# Altium schematic sheet DTM13.SchDoc
size A4; SheetNumber: 11; SheetTotal: 14
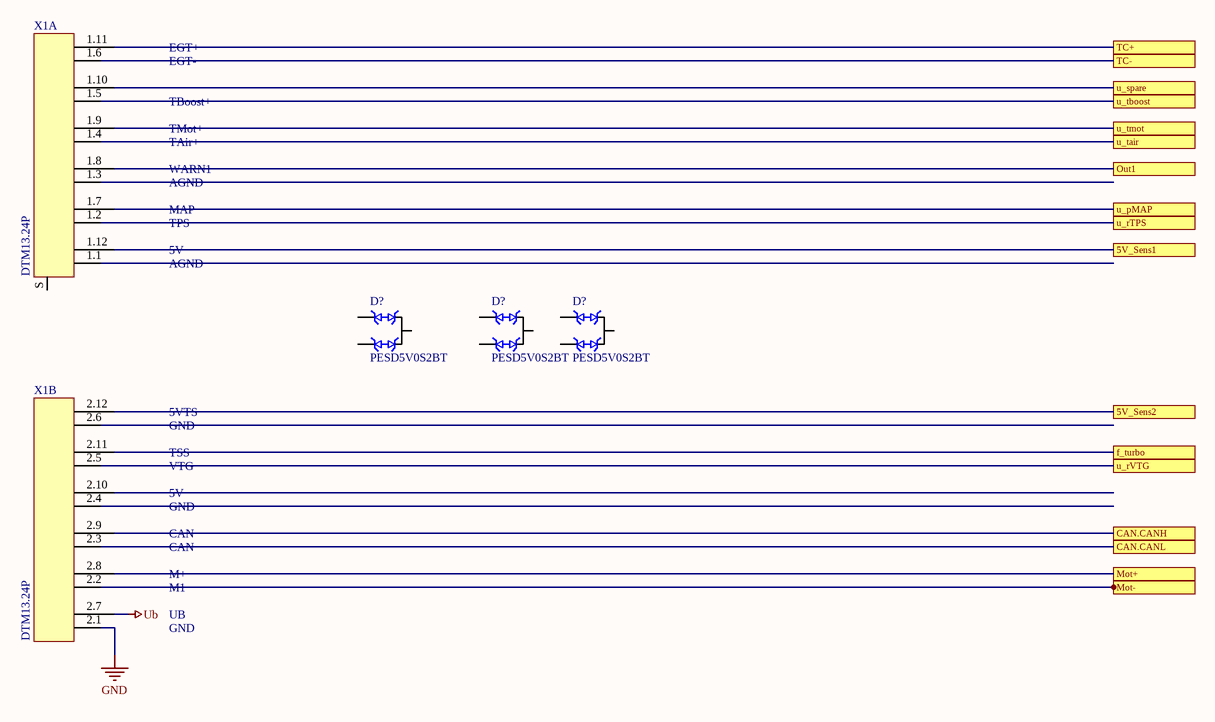
[diagram p0: DTM13.SchDoc]

## Parts
(Parts that share a designator on the sheet are numbered #1, #2 ... from top to bottom, then left to right.)
D?#1  PESD5V0S2BT  [ONSC-SOT-323-3-Generic]
D?#2  PESD5V0S2BT  [ONSC-SOT-323-3-Generic]
D?#3  PESD5V0S2BT  [ONSC-SOT-323-3-Generic]
X1  DTM13.24P  [DTM13-24P]  (parts A,B of 2)

## Ports
5V_Sens1, 5V_Sens2, CAN.CANH, CAN.CANL, f_turbo, Mot+, Mot-, Out1, TC+, TC-, u_pMAP, u_rTPS, u_rVTG, u_spare, u_tair, u_tboost, u_tmot

## Nets
GND: X1.2.1
Ub: X1.2.7
5V_Sens1: X1.1.12 ; port 5V_Sens1
5V_Sens2: X1.2.12 ; port 5V_Sens2
CAN.CANH: X1.2.9 ; port CAN.CANH
CAN.CANL: X1.2.3 ; port CAN.CANL
f_turbo: X1.2.11 ; port f_turbo
Mot+: X1.2.8 ; port Mot+
Mot-: X1.2.2 ; port Mot-
Out1: X1.1.8 ; port Out1
TC+: X1.1.11 ; port TC+
TC-: X1.1.6 ; port TC-
u_pMAP: X1.1.7 ; port u_pMAP
u_rTPS: X1.1.2 ; port u_rTPS
u_rVTG: X1.2.5 ; port u_rVTG
u_spare: X1.1.10 ; port u_spare
u_tair: X1.1.4 ; port u_tair
u_tboost: X1.1.5 ; port u_tboost
u_tmot: X1.1.9 ; port u_tmot

Not connected (* = marked no-connect by the designer): D?#1 1 2 3; D?#2 1 2 3; D?#3 1 2 3; X1 1.1 1.3 2.4 2.6 2.10 S

## Notes on the sheet
- EGT+
- EGT-
- TMot+
- TBoost+
- TAir+
- WARN1
- AGND
- 5V
- TPS
- MAP
- TSS
- VTG
- 5VTS
- GND
- CAN
- M+
- M1
- UB

## Library data of the parts
D?#1-D?#3 = CMP-004-00081-A01: TVS DIODE 5VWM 14VC SOT23 / ESD Suppressor Diode TVS Bi-Dir 5V Automotive 3-Pin SOT-23; Clamping Voltage (Max): 10V; Directionality: Bidirectional; Leakage Current (Max): 5nA; Breakdown Voltage (Min): 5.5V; Pins: 3; Case/Package: SOT-23; Standoff Voltage: 5V; Mounting Technology: SMT; RoHS Compliant: Yes; Operating Temperature (Min): -55°C; Operating Temperature (Max): 150°C
X1 = CMP-005-000001-3: Source: Deutsch.SchLib; Design Item ID: DTM13.24P; Pin Count: 25; Component Type: Standard